# Altium project DE-020717.PrjPcb
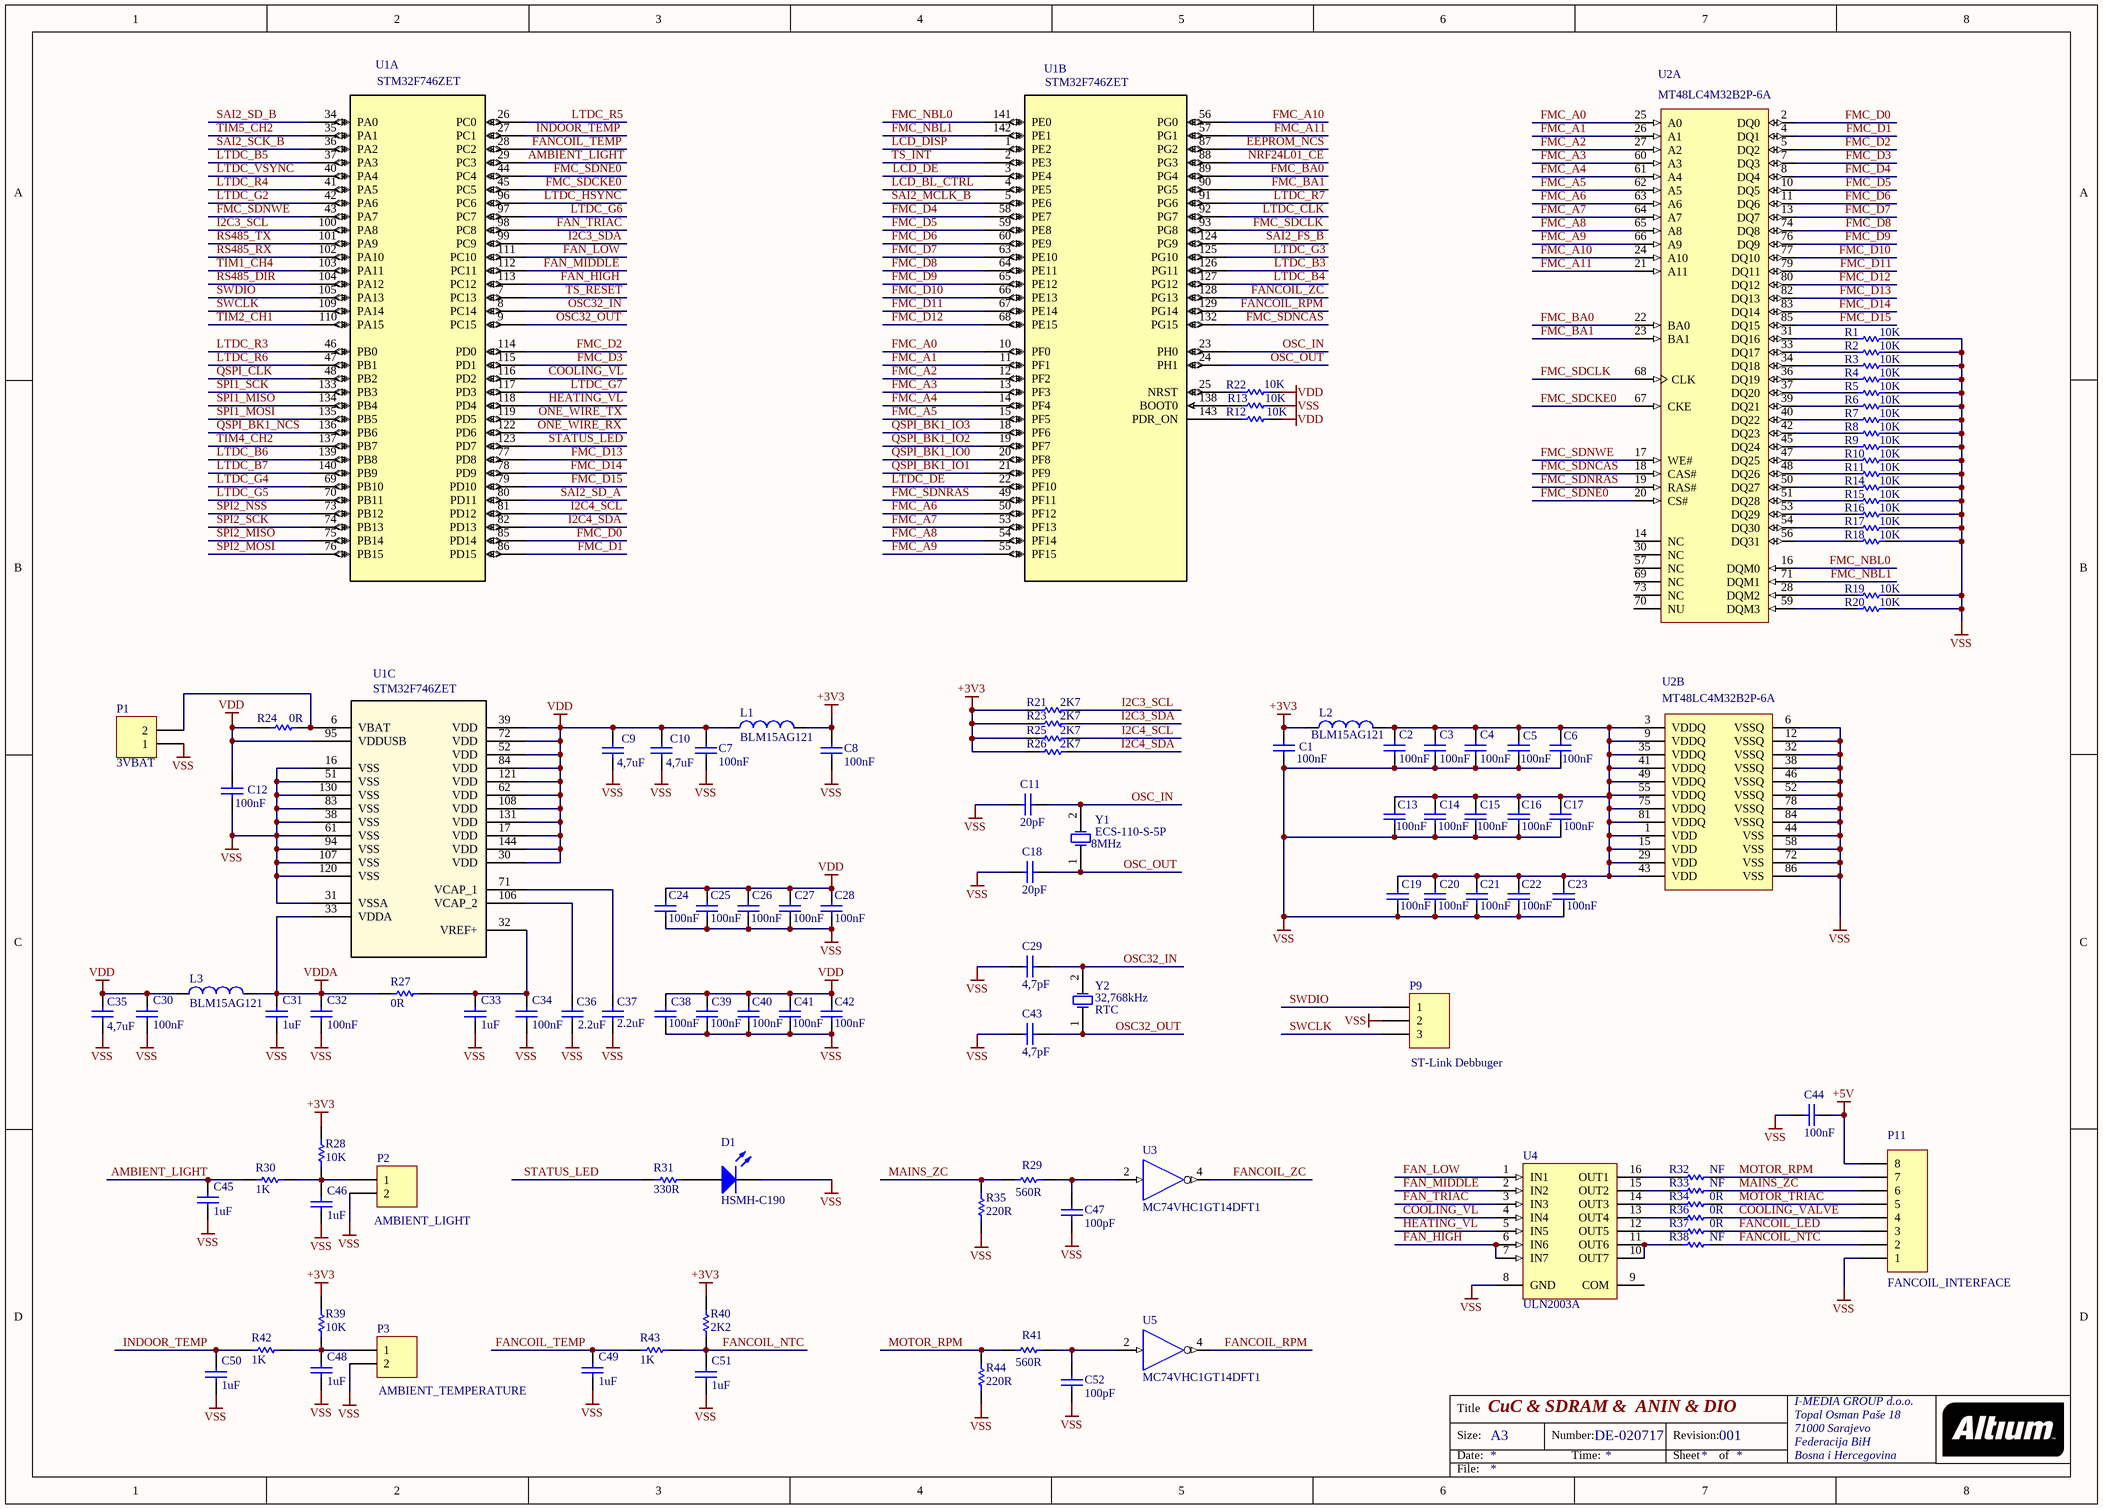
[diagram p0: DE-020717_1.SchDoc]
2 sheets, 178 parts. Net scope: global (net labels, ports and power ports of the same name join across sheets).
Board file: DE-020717.PcbDoc
Sheets:
  DE-020717_1.SchDoc
  DE-020717_2.SchDoc

## Sheet DE-020717_1.SchDoc: CuC & SDRAM &  ANIN & DIO
size A3; Author: eldar6776@hotmail.com; DrawnBy: Dedic Eldar; Organization: I-MEDIA GROUP d.o.o.; Address1: Topal Osman Paše 18; Address2: 71000 Sarajevo; Address3: Federacija BiH; Address4: Bosna i Hercegovina; DocumentNumber: DE-020717; Revision: 001

### Parts
C1  100nF  [0603]
C2  100nF  [0603]
C3  100nF  [0603]
C4  100nF  [0603]
C5  100nF  [0603]
C6  100nF  [0603]
C7  100nF  [0603]
C8  100nF  [0603]
C9  value 4,7uF  [0805]  (hidden comment: 4u7)
C10  value 4,7uF  [0805]  (hidden comment: 4u7)
C11  20pF  [0603]
C12  100nF  [0603]
C13  100nF  [0603]
C14  100nF  [0603]
C15  100nF  [0603]
C16  100nF  [0603]
C17  100nF  [0603]
C18  20pF  [0603]
C19  100nF  [0603]
C20  100nF  [0603]
C21  100nF  [0603]
C22  100nF  [0603]
C23  100nF  [0603]
C24  100nF  [0603]
C25  100nF  [0603]
C26  100nF  [0603]
C27  100nF  [0603]
C28  100nF  [0603]
C29  4,7pF  [0603]
C30  100nF  [0603]
C31  value 1uF  [0603]  (hidden comment: 100nF)
C32  100nF  [0603]
C33  value 1uF  [0603]  (hidden comment: 100nF)
C34  100nF  [0603]
C35  value 4,7uF  [0805]  (hidden comment: 4u7)
C36  value 2.2uF  [0603]  (hidden comment: 100nF)
C37  value 2.2uF  [0603]  (hidden comment: 100nF)
C38  100nF  [0603]
C39  100nF  [0603]
C40  100nF  [0603]
C41  100nF  [0603]
C42  100nF  [0603]
C43  4,7pF  [0603]
C44  100nF  [0603]
C45  value 1uF  [0603]  (hidden comment: 100nF)
C46  value 1uF  [0603]  (hidden comment: 100nF)
C47  100pF  [0603]
C48  value 1uF  [0603]  (hidden comment: 100nF)
C49  value 1uF  [0603]  (hidden comment: 100nF)
C50  value 1uF  [0603]  (hidden comment: 100nF)
C51  value 1uF  [0603]  (hidden comment: 100nF)
C52  100pF  [0603]
D1  HSMH-C190  [1.6X0.8X0.8A]
L1  BLM15AG121  [0603]
L2  BLM15AG121  [0603]
L3  BLM15AG121  [0603]
P1  3VBAT  [HDR1X2]
P2  AMBIENT_LIGHT  [HDR1X2]
P3  AMBIENT_TEMPERATURE  [HDR1X2]
P9  ST-Link Debbuger  [HDR1X3]
P11  FANCOIL_INTERFACE  [HDR1X8]
R1  10K  [2-0402]
R2  10K  [2-0402]
R3  10K  [2-0402]
R4  10K  [2-0402]
R5  10K  [2-0402]
R6  10K  [2-0402]
R7  10K  [2-0402]
R8  10K  [2-0402]
R9  10K  [2-0402]
R10  10K  [2-0402]
R11  10K  [2-0402]
R12  10K  [ERA-0603]
R13  10K  [ERA-0603]
R14  10K  [2-0402]
R15  10K  [2-0402]
R16  10K  [2-0402]
R17  10K  [2-0402]
R18  10K  [2-0402]
R19  10K  [2-0402]
R20  10K  [2-0402]
R21  2K7  [ERA-0603]
R22  10K  [ERA-0603]
R23  2K7  [ERA-0603]
R24  0R  [ERA-0603]
R25  2K7  [ERA-0603]
R26  2K7  [ERA-0603]
R27  0R  [ERA-0603]
R28  10K  [ERA-0603]
R29  560R  [ERA-0603]
R30  1K  [ERA-0603]
R31  330R  [ERA-0603]
R32  NF  [ERA-0603]
R33  NF  [ERA-0603]
R34  0R  [ERA-0603]
R35  220R  [ERA-0603]
R36  0R  [ERA-0603]
R37  0R  [ERA-0603]
R38  NF  [ERA-0603]
R39  10K  [ERA-0603]
R40  2K2  [ERA-0603]
R41  560R  [ERA-0603]
R42  1K  [ERA-0603]
R43  1K  [ERA-0603]
R44  220R  [ERA-0603]
U1  STM32F746ZET  [LQFP-144_20X20mm]  (parts A,B,C of 3)
U2  MT48LC4M32B2P-6A  [MICT-P-86_N]  (parts A,B of 2)
U3  MC74VHC1GT14DFT1  [419A-01_N]
U4  ULN2003A  [SO16_N]
U5  MC74VHC1GT14DFT1  [419A-01_N]
Y1  ECS-110-S-5P  value 8MHz  [CSM-7]
Y2  RTC  value 32,768kHz  [R38]

### Nets
+3V3: C1.2 C8.2 L1.2 L2.1 R21.1 R23.1 R25.1 R26.1 R28.2 R39.1 R40.2 U3.5(VDD) U5.5(VDD)
+5V: C44.2 P11.8
VDD: C7.2 C9.2 C10.2 C12.1 C24.2 C25.2 C26.2 C27.2 C28.2 C30.2 C35.2 C38.2 C39.2 C40.2 C41.2 C42.2 L1.1 L3.1 R12.2 R22.2 R24.1 U1.17(VDD) U1.30(VDD) U1.39(VDD) U1.52(VDD) U1.62(VDD) U1.72(VDD) U1.84(VDD) U1.95(VDDUSB) U1.108(VDD) U1.121(VDD) U1.131(VDD) U1.144(VDD)
VDDA: C31.2 C32.2 L3.2 R27.1 U1.33(VDDA)
VSS: C1.1 C2.1 C3.1 C4.1 C5.1 C6.1 C7.1 C8.1 C9.1 C10.1 C11.1 C12.2 C13.1 C14.1 C15.1 C16.1 C17.1 C18.1 C19.1 C20.1 C21.1 C22.1 C23.1 C24.1 C25.1 C26.1 C27.1 C28.1 C29.1 C30.1 C31.1 C32.1 C33.1 C34.1 C35.1 C36.1 C37.1 C38.1 C39.1 C40.1 C41.1 C42.1 C43.1 C44.1 C45.1 C46.1 C47.1 C48.1 C49.1 C50.1 C51.1 C52.1 D1.2(K) P1.1 P2.2 P3.2 P9.2 P11.1 R1.2 R2.2 R3.2 R4.2 R5.2 R6.2 R7.2 R8.2 R9.2 R10.2 R11.2 R13.2 R14.2 R15.2 R16.2 R17.2 R18.2 R19.2 R20.2 R35.1 R44.1 U1.16(VSS) U1.31(VSSA) U1.38(VSS) U1.51(VSS) U1.61(VSS) U1.83(VSS) U1.94(VSS) U1.107(VSS) U1.120(VSS) U1.130(VSS) U2.6(VSSQ) U2.12(VSSQ) U2.32(VSSQ) U2.38(VSSQ) U2.44(VSS) U2.46(VSSQ) U2.52(VSSQ) U2.58(VSS) U2.72(VSS) U2.78(VSSQ) U2.84(VSSQ) U2.86(VSS) U3.3(GND) U4.8(GND) U5.3(GND)
AMBIENT_LIGHT: C45.2 R30.1 U1.29(PC3)
COOLING_VALVE: P11.4 R36.2
COOLING_VL: U1.116(PD2) U4.4(IN4)
EEPROM_NCS: U1.87(PG2)
FAN_HIGH: U1.113(PC12) U4.6(IN6) U4.7(IN7)
FAN_LOW: U1.111(PC10) U4.1(IN1)
FAN_MIDDLE: U1.112(PC11) U4.2(IN2)
FAN_TRIAC: U1.98(PC8) U4.3(IN3)
FANCOIL_LED: P11.3 R37.2
FANCOIL_NTC: C51.2 P11.2 R38.2 R40.1 R43.2
FANCOIL_RPM: U1.129(PG14) U5.4(~{Y})
FANCOIL_TEMP: C49.2 R43.1 U1.28(PC2)
FANCOIL_ZC: U1.128(PG13) U3.4(~{Y})
FMC_A0: U1.10(PF0) U2.25(A0)
FMC_A1: U1.11(PF1) U2.26(A1)
FMC_A2: U1.12(PF2) U2.27(A2)
FMC_A3: U1.13(PF3) U2.60(A3)
FMC_A4: U1.14(PF4) U2.61(A4)
FMC_A5: U1.15(PF5) U2.62(A5)
FMC_A6: U1.50(PF12) U2.63(A6)
FMC_A7: U1.53(PF13) U2.64(A7)
FMC_A8: U1.54(PF14) U2.65(A8)
FMC_A9: U1.55(PF15) U2.66(A9)
FMC_A10: U1.56(PG0) U2.24(A10)
FMC_A11: U1.57(PG1) U2.21(A11)
FMC_BA0: U1.89(PG4) U2.22(BA0)
FMC_BA1: U1.90(PG5) U2.23(BA1)
FMC_D0: U1.85(PD14) U2.2(DQ0)
FMC_D1: U1.86(PD15) U2.4(DQ1)
FMC_D2: U1.114(PD0) U2.5(DQ2)
FMC_D3: U1.115(PD1) U2.7(DQ3)
FMC_D4: U1.58(PE7) U2.8(DQ4)
FMC_D5: U1.59(PE8) U2.10(DQ5)
FMC_D6: U1.60(PE9) U2.11(DQ6)
FMC_D7: U1.63(PE10) U2.13(DQ7)
FMC_D8: U1.64(PE11) U2.74(DQ8)
FMC_D9: U1.65(PE12) U2.76(DQ9)
FMC_D10: U1.66(PE13) U2.77(DQ10)
FMC_D11: U1.67(PE14) U2.79(DQ11)
FMC_D12: U1.68(PE15) U2.80(DQ12)
FMC_D13: U1.77(PD8) U2.82(DQ13)
FMC_D14: U1.78(PD9) U2.83(DQ14)
FMC_D15: U1.79(PD10) U2.85(DQ15)
FMC_NBL0: U1.141(PE0) U2.16(DQM0)
FMC_NBL1: U1.142(PE1) U2.71(DQM1)
FMC_SDCKE0: U1.45(PC5) U2.67(CKE)
FMC_SDCLK: U1.93(PG8) U2.68(CLK)
FMC_SDNCAS: U1.132(PG15) U2.18(CAS#)
FMC_SDNE0: U1.44(PC4) U2.20(CS#)
FMC_SDNRAS: U1.49(PF11) U2.19(RAS#)
FMC_SDNWE: U1.43(PA7) U2.17(WE#)
HEATING_VL: U1.118(PD4) U4.5(IN5)
I2C3_SCL: R21.2 U1.100(PA8)
I2C3_SDA: R23.2 U1.99(PC9)
I2C4_SCL: R25.2 U1.81(PD12)
I2C4_SDA: R26.2 U1.82(PD13)
INDOOR_TEMP: C50.2 R42.1 U1.27(PC1)
LCD_BL_CTRL: U1.4(PE5)
LCD_DE: U1.3(PE4)
LCD_DISP: U1.1(PE2)
LTDC_B3: U1.126(PG11)
LTDC_B4: U1.127(PG12)
LTDC_B5: U1.37(PA3)
LTDC_B6: U1.139(PB8)
LTDC_B7: U1.140(PB9)
LTDC_CLK: U1.92(PG7)
LTDC_DE: U1.22(PF10)
LTDC_G2: U1.42(PA6)
LTDC_G3: U1.125(PG10)
LTDC_G4: U1.69(PB10)
LTDC_G5: U1.70(PB11)
LTDC_G6: U1.97(PC7)
LTDC_G7: U1.117(PD3)
LTDC_HSYNC: U1.96(PC6)
LTDC_R3: U1.46(PB0)
LTDC_R4: U1.41(PA5)
LTDC_R5: U1.26(PC0)
LTDC_R6: U1.47(PB1)
LTDC_R7: U1.91(PG6)
LTDC_VSYNC: U1.40(PA4)
MAINS_ZC: P11.6 R29.1 R33.2 R35.2
MOTOR_RPM: P11.7 R32.2 R41.1 R44.2
MOTOR_TRIAC: P11.5 R34.2
NRF24L01_CE: U1.88(PG3)
ONE_WIRE_RX: U1.122(PD6)
ONE_WIRE_TX: U1.119(PD5)
OSC32_IN: C29.2 U1.8(PC14) Y2.2(OSC2)
OSC32_OUT: C43.2 U1.9(PC15) Y2.1(OSC1)
OSC_IN: C11.2 U1.23(PH0) Y1.2(OSC2)
OSC_OUT: C18.2 U1.24(PH1) Y1.1(OSC1)
QSPI_BK1_IO0: U1.20(PF8)
QSPI_BK1_IO1: U1.21(PF9)
QSPI_BK1_IO2: U1.19(PF7)
QSPI_BK1_IO3: U1.18(PF6)
QSPI_BK1_NCS: U1.136(PB6)
QSPI_CLK: U1.48(PB2)
RS485_DIR: U1.104(PA12)
RS485_RX: U1.102(PA10)
RS485_TX: U1.101(PA9)
SAI2_FS_B: U1.124(PG9)
SAI2_MCLK_B: U1.5(PE6)
SAI2_SCK_B: U1.36(PA2)
SAI2_SD_A: U1.80(PD11)
SAI2_SD_B: U1.34(PA0)
SPI1_MISO: U1.134(PB4)
SPI1_MOSI: U1.135(PB5)
SPI1_SCK: U1.133(PB3)
SPI2_MISO: U1.75(PB14)
SPI2_MOSI: U1.76(PB15)
SPI2_NSS: U1.73(PB12)
SPI2_SCK: U1.74(PB13)
STATUS_LED: R31.2 U1.123(PD7)
SWCLK: P9.3 U1.109(PA14)
SWDIO: P9.1 U1.105(PA13)
TIM1_CH4: U1.103(PA11)
TIM2_CH1: U1.110(PA15)
TIM4_CH2: U1.137(PB7)
TIM5_CH2: U1.35(PA1)
TS_INT: U1.2(PE3)
TS_RESET: U1.7(PC13)
NetC2_2: C2.2 C3.2 C4.2 C5.2 C6.2 C13.2 C14.2 C15.2 C16.2 C17.2 C19.2 C20.2 C21.2 C22.2 C23.2 L2.2 U2.1(VDD) U2.3(VDDQ) U2.9(VDDQ) U2.15(VDD) U2.29(VDD) U2.35(VDDQ) U2.41(VDDQ) U2.43(VDD) U2.49(VDDQ) U2.55(VDDQ) U2.75(VDDQ) U2.81(VDDQ)
NetC33_2: C33.2 C34.2 R27.2 U1.32(VREF+)
NetC36_2: C36.2 U1.106(VCAP_2)
NetC37_2: C37.2 U1.71(VCAP_1)
NetC46_2: C46.2 P2.1 R28.1 R30.2
NetC47_2: C47.2 R29.2 U3.2(A)
NetC48_2: C48.2 P3.1 R39.2 R42.2
NetC52_2: C52.2 R41.2 U5.2(A)
NetD1_1: D1.1(A) R31.1
NetP1_2: P1.2 R24.2 U1.6(VBAT)
NetR1_1: R1.1 U2.31(DQ16)
NetR2_1: R2.1 U2.33(DQ17)
NetR3_1: R3.1 U2.34(DQ18)
NetR4_1: R4.1 U2.36(DQ19)
NetR5_1: R5.1 U2.37(DQ20)
NetR6_1: R6.1 U2.39(DQ21)
NetR7_1: R7.1 U2.40(DQ22)
NetR8_1: R8.1 U2.42(DQ23)
NetR9_1: R9.1 U2.45(DQ24)
NetR10_1: R10.1 U2.47(DQ25)
NetR11_1: R11.1 U2.48(DQ26)
NetR12_1: R12.1 U1.143(PDR_ON)
NetR13_1: R13.1 U1.138(BOOT0)
NetR14_1: R14.1 U2.50(DQ27)
NetR15_1: R15.1 U2.51(DQ28)
NetR16_1: R16.1 U2.53(DQ29)
NetR17_1: R17.1 U2.54(DQ30)
NetR18_1: R18.1 U2.56(DQ31)
NetR19_1: R19.1 U2.28(DQM2)
NetR20_1: R20.1 U2.59(DQM3)
NetR22_1: R22.1 U1.25(NRST)
NetR32_1: R32.1 U4.16(OUT1)
NetR33_1: R33.1 U4.15(OUT2)
NetR34_1: R34.1 U4.14(OUT3)
NetR36_1: R36.1 U4.13(OUT4)
NetR37_1: R37.1 U4.12(OUT5)
NetR38_1: R38.1 U4.10(OUT7) U4.11(OUT6)

Not connected (* = marked no-connect by the designer): U2 14(NC) 30(NC) 57(NC) 69(NC) 70(NU) 73(NC); U4 9(COM)

### Notes on the sheet
- Title
- Size:
- Date:
- A3
- Number:
- Time:
- Revision:
- Sheet
- of
- File:

### Library data of the parts
C1-C8 C11-C34 C36-C52 = C0603: Ceramic Chip Capacitor - Standard; Note: Footprint corresponds to dimensions for bulk cassette packaging. This case size has tightened tolerances.; Published: 17-Jul-2002; LatestRevisionDate: 19-Mar-2004; LatestRevisionNote: Silkscreen size reduced.; DatasheetDocument: Mar-2001; PackageDocument: Mar-2001; PackageReference: 0603; Publisher: Altium Limited; Code_JEITA: 0603; Code_IPC: 1608 [0603]; ComponentLink1Description: Manufacturer Link; ComponentLink1URL: http://www.kemet.com/; ComponentLink2Description: Datasheet; ComponentLink2URL: http://www.kemet.com/kemet/web/homepage/kechome.nsf/vapubfilesname/F3102TA.pdf/$file/F3102TA.pdf
  C1-C8 C12-C17 C19-C28 C30 C32 C34 C38-C42 C44: Value: 100nF
  C11 C18: Value: 20pF
  C29 C43: Value: 4,7pF
  C47 C52: Value: 100pF
C9 C10 C35 = C0805: Ceramic Chip Capacitor - Standard; Note: Footprint corresponds to dimensions for bulk cassette packaging. This case size has tightened tolerances.; Published: 17-Jul-2002; LatestRevisionDate: 19-Mar-2004; LatestRevisionNote: Silkscreen size reduced.; DatasheetDocument: Mar-2001; PackageDocument: Mar-2001; PackageReference: 0805; Publisher: Altium Limited; Code_JEITA: 0805; Code_IPC: 2012[0805]; ComponentLink1Description: Manufacturer Link; ComponentLink1URL: http://www.kemet.com/; ComponentLink2Description: Datasheet; ComponentLink2URL: http://www.kemet.com/kemet/web/homepage/kechome.nsf/vapubfilesname/F3102TA.pdf/$file/F3102TA.pdf
D1 = HSMH-C190: Surface Mount Chip LED, Red; LuminousIntensity: 6.3mcd (Minimum).; PCB_Layout: Complies with manufacturer's recommendation.; Note: Anode mark shown on package.; Published: 11-Dec-2002; LatestRevisionDate: 27-Jun-2008; LatestRevisionNote: Polarity swapped to match Anode Mark.; DatasheetVersion: 30-Apr-2002; PackageVersion: Mar-2002; PackageReference: 1.6X0.8X0.8A; Publisher: Altium Limited; PackageDescription: SM LED; 2 Flat Leads; LED_Colour: Red; ComponentLink1Description: Manufacturer Link; ComponentLink1URL: http://www.avagotech.com/; ComponentLink2Description: Datasheet; ComponentLink2URL: http://cp.literature.agilent.com/litweb/pdf/5988-6271EN.pdf
L1-L3 = Inductor_SMD: Inductor; Code_IEC: 1005; Published: 8-Jun-2000; LatestRevisionDate: 29-May-2009; LatestRevisionNote: IPC-7351 Footprint Added.; PackageReference: 0402-A; Publisher: Altium Limited; PackageDescription: Chip Inductor; Code_JEITA: 0402
P1-P3 = Header 2: Header, 2-Pin; LatestRevisionDate: 17-Jul-2002; LatestRevisionNote: Re-released for DXP Platform.; Publisher: Altium Limited
P9 = Header 3: Header, 3-Pin; LatestRevisionDate: 17-Jul-2002; LatestRevisionNote: Re-released for DXP Platform.; Publisher: Altium Limited
P11 = Header 8: Header, 8-Pin; LatestRevisionDate: 17-Jul-2002; LatestRevisionNote: Re-released for DXP Platform.; Publisher: Altium Limited
R1-R11 R14-R20 = ERJ2GE: Thick Film Chip Resistor, 1 Ohm to 2.2M Ohm Range, 5% Tolerance, 0402 Size, 0.063 W; Note: If flow soldering, adjust pad width of PCB Footprint to 0.7 - 0.8 times the width of the resistor.; Published: 17-Dec-2003; LatestRevisionDate: 19-Mar-2004; LatestRevisionNote: Silkscreen size reduced.; PackageDocument: Mar-2003; PackageReference: 2-0402; Publisher: Altium Limited; Code_IPC: 1005 [0402]; ComponentLink1Description: Manufacturer Link; ComponentLink1URL: http://www.panasonic.com/industrial/components/resistive_products.htm; ComponentLink2Description: Datasheet; ComponentLink2URL: http://www.panasonic.com/industrial/components/pdf/AOA0000CE1.pdf
R12 R13 R21-R44 = ERA3Y: Rectangular Thick Film Chip Resistor, 10 Ohm to 330k Ohm Range, 0.1% and 0.5% Tolerance, 0603 Size, 0.063 W; Note: If flow soldering, adjust pad width of PCB Footprint to 0.7 - 0.8 times the width of the resistor.; Published: 17-Dec-2003; LatestRevisionDate: 19-Mar-2004; LatestRevisionNote: Silkscreen size reduced.; PackageDocument: Mar-2003; PackageReference: ERA-0603; Publisher: Altium Limited; Code_IPC: 1608 [0603]; ComponentLink1Description: Manufacturer Link; ComponentLink1URL: http://www.panasonic.com/industrial/components/resistive_products.htm; ComponentLink2Description: Datasheet; ComponentLink2URL: http://www.panasonic.com/industrial/components/pdf/AOA0000CE8.pdf
U1 = STM32F74XZXT: STM32F746ZET ARM Cortex M7 microcontroller; Vendor: STMicroelectronics; C: Copyright (C) 2016 Accelerated Designs. All rights reserved; Manufacturer_Part_Number: stm32f74xzxt; Copyright: Copyright (C) 2016 Accelerated Designs. All rights reserved; RefDes: RefDes; Type: Type; Value: Value
U2 = MT48LC4M32B2P-6A: 128Mb PC133 SDR SDRAM, 4Mb x 32, 6ns, 3.3V, 0 to 70 degC, 86-Pin TSOP, Pb-Free; Manufacturer: Micron; CL: CL = 3; Clock Rate: 166 MHz; Op. Temp.: 0C to +70C; DatasheetVersion: Rev.Q; PackageVersion: Rev.Q; PackageReference: MICT-P-86; PackageDescription: 86-PinThin Small Outline Package, 10.16 x 22.22 mm, Pitch 0.5 mm; Cycle Time: 6ns; Data Rate: PC133; Density: 128Mb; Depth: 4Mb; RoHS: Yes; Voltage: 3.3V; Width: x32; Mounting Technology: Surface Mount; PartNumber: MT48LC4M32B2P-6A; ComponentLink1Description: Manufacturer URL; ComponentLink1URL: http://www.micron.com/; ComponentLink2Description: Datasheet; ComponentLink2URL: http://www.micron.com/~/media/Documents/Products/Data%20Sheet/DRAM/128mb_x32_sdram.pdf; ComponentLink3Description: Package Specification; ComponentLink3URL: http://www.micron.com/~/media/Documents/Products/Data%20Sheet/DRAM/128mb_x32_sdram.pdf
U3 U5 = MC74VHC1GT14DFT1: Schmitt-Trigger Inverter / Logic Level Shifter with LSTTL-Compatible Inputs; Note: Pin 1 is NC and is not drawn.; Published: 15-Apr-2002; LatestRevisionDate: 12-Dec-2006; LatestRevisionNote: IPC-7351 Footprint Added.; DatasheetVersion: Nov-1999; PackageVersion: Oct-1999; PackageReference: 419A-01; Publisher: Altium Limited; PackageDescription: 5-Pin SOT-353 Package 0.65 mm Pitch, 2.1 mm Lead Span; ComponentLink1Description: Manufacturer Link; ComponentLink1URL: http://www.onsemi.com/; ComponentLink2Description: Datasheet; ComponentLink2URL: http://www.onsemi.com/pub/Collateral/MC74VHC1GT14-D.PDF
U4 = ULN2003D: Seven Darlington Array; Published: 8-Jun-2000; LatestRevisionDate: 13-Apr-2006; LatestRevisionNote: IPC-7351 Footprint Added.; DatasheetVersion: Sep-1998; PackageVersion: May-1998; PackageReference: SO16; Publisher: Altium Limited; PackageDescription: 16-Pin Small Outline Integrated Circuit 1.27 mm Pitch; Code_IPC: SOIC127P600-16; ComponentLink1Description: Manufacturer Link; ComponentLink1URL: http://www.st.com/; ComponentLink2Description: Datasheet; ComponentLink2URL: http://www.st.com/stonline/products/literature/ds/5279/uln2001.pdf
Y1 = ECS-110-S-5P: Crystal Oscillator; Published: 17-Jul-2002; DatasheetDocument: 18-Apr-2000; PackageReference: CSM-7; Publisher: Altium Limited; ComponentLink1Description: Manufacturer Link; ComponentLink1URL: http://www.ecsxtal.com/; ComponentLink2Description: Datasheet; ComponentLink2URL: http://www.ecsxtal.com/pdf3/CSM_7.pdf
Y2 = XTAL: Crystal Oscillator; Published: 8-Jun-2000; LatestRevisionDate: 17-Jul-2002; LatestRevisionNote: Re-released for DXP Platform.; PackageReference: R38; Publisher: Altium Limited; PackageDescription: Crystal, Thru-Hole; 2 Leads; Body 3.1 x 8.2 mm (Dia.xH)

## Sheet DE-020717_2.SchDoc: COM & WIFI
size A3; Author: eldar6776@hotmail.com; DrawnBy: Eldar Dedic; Organization: I-MEDIA GROUP d.o.o.; Address1: Topal Osman Paše 18; Address2: Sarajevo 71000; Address3: Federacija BiH; Address4: Bosna i Hercegovina; DocumentNumber: DE-020717; Revision: 001
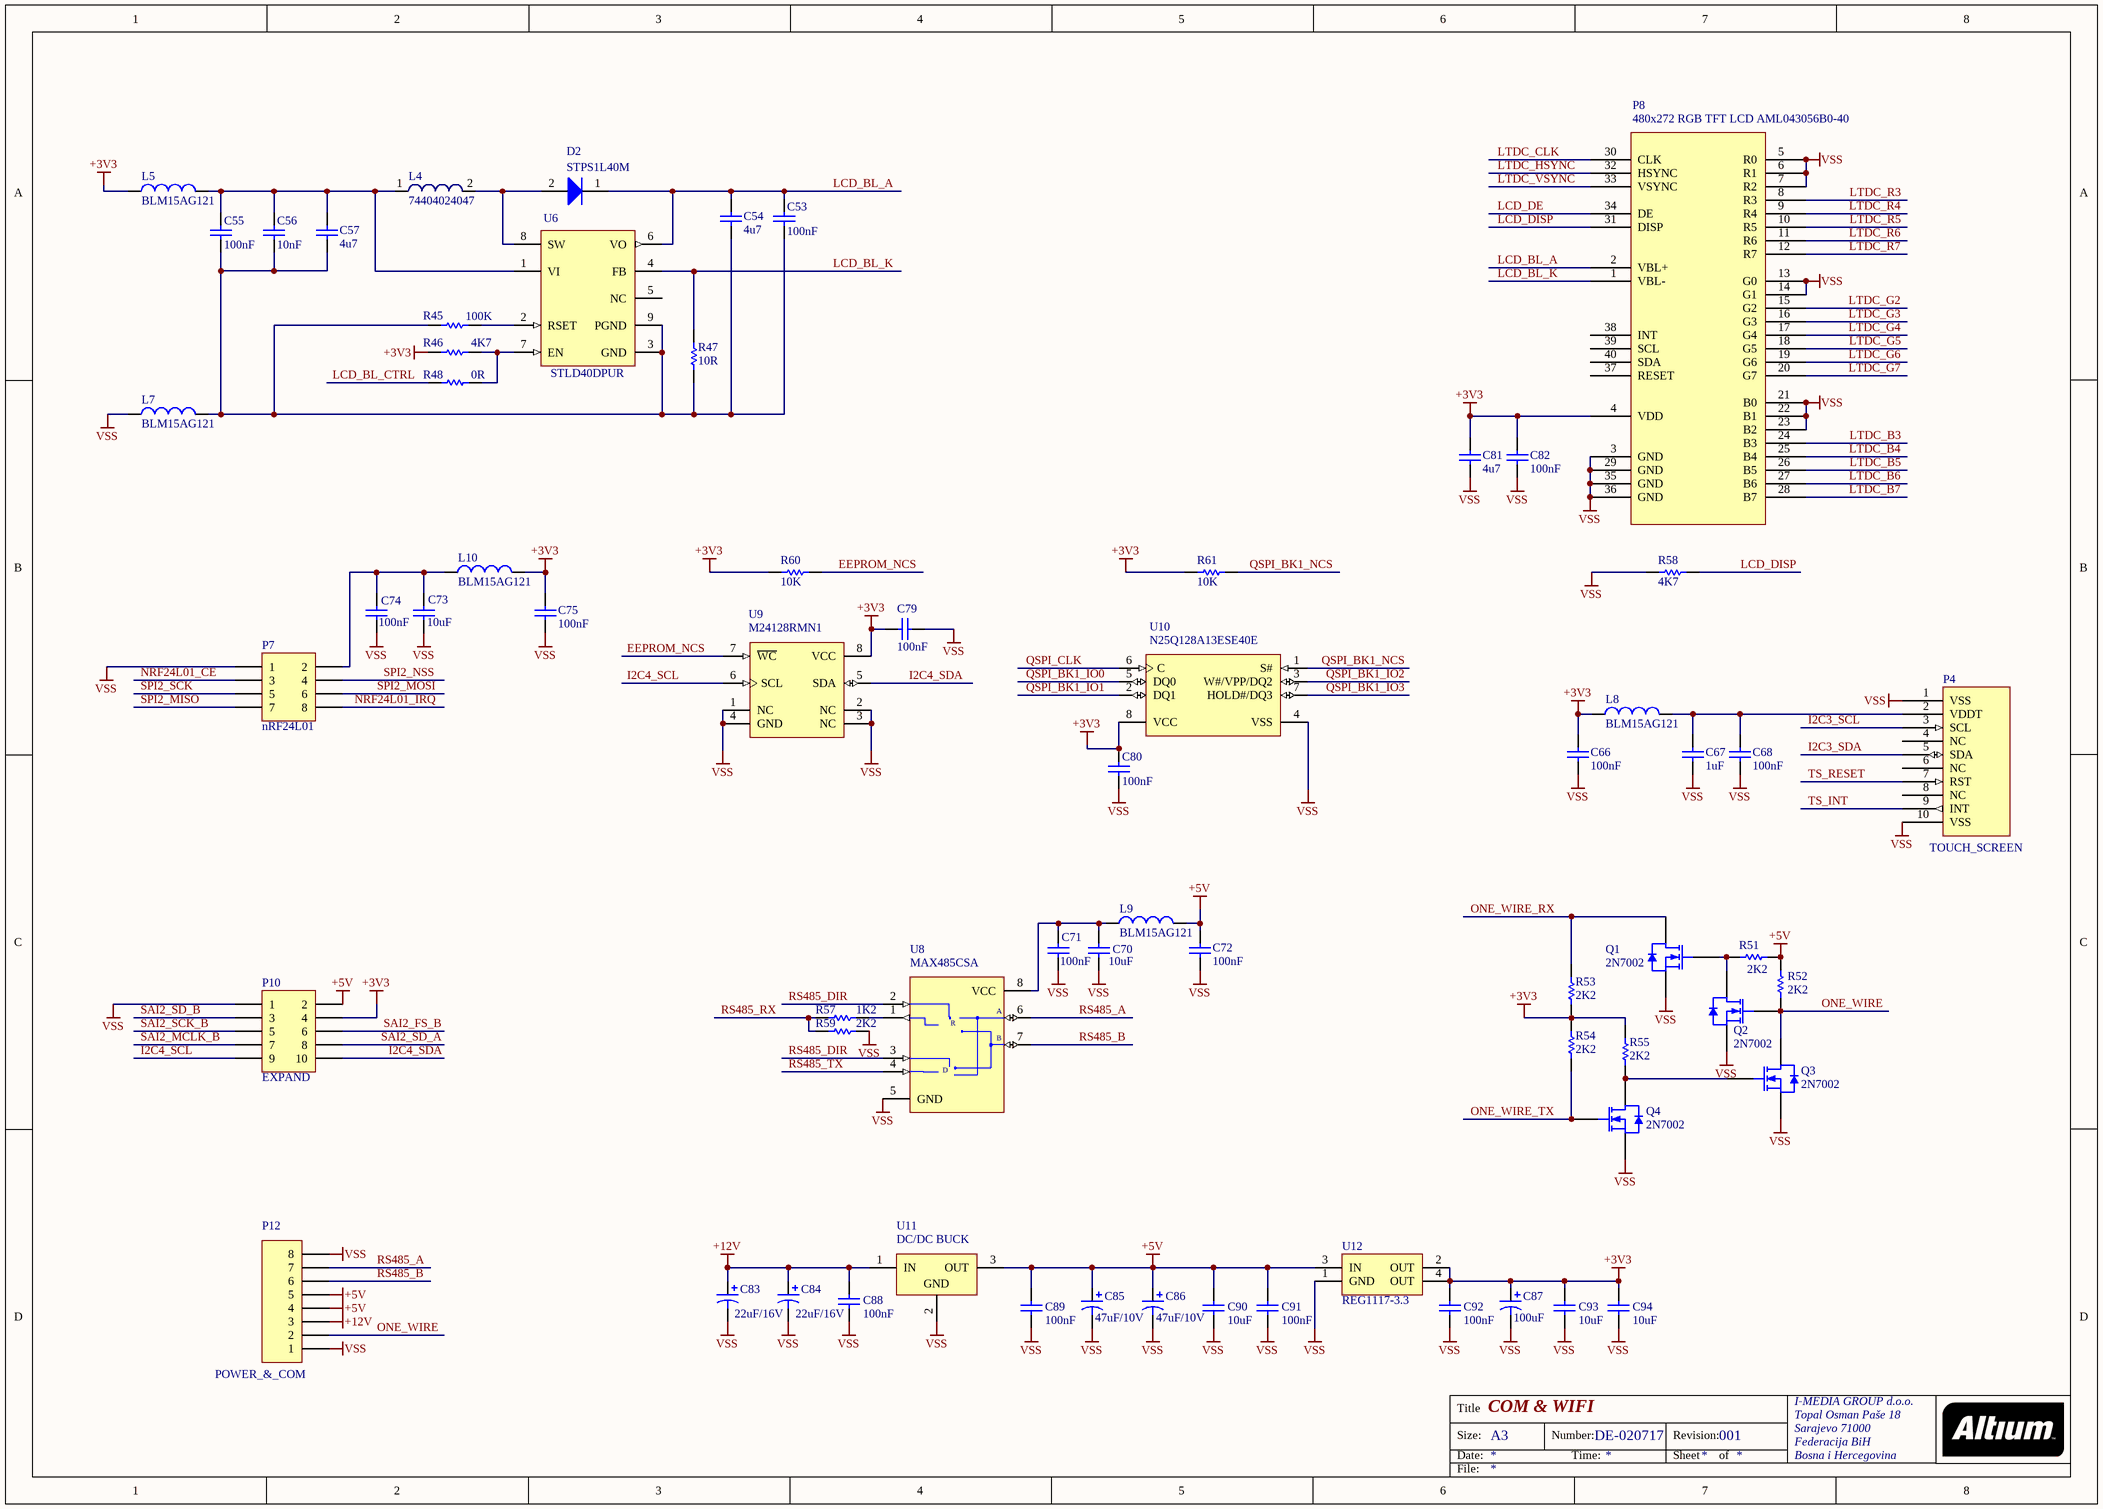
[diagram p1: DE-020717_2.SchDoc]

### Parts
C53  100nF  [0603]
C54  4u7  [0805]
C55  100nF  [0603]
C56  value 10nF  [0603]  (hidden comment: 100nF)
C57  4u7  [0805]
C66  100nF  [0603]
C67  1uF  [0603]
C68  100nF  [0603]
C70  value 10uF  [0805]  (hidden comment: 4u7)
C71  100nF  [0603]
C72  100nF  [0603]
C73  value 10uF  [0805]  (hidden comment: 4u7)
C74  100nF  [0603]
C75  100nF  [0603]
C79  100nF  [0603]
C80  100nF  [0603]
C81  4u7  [0805]
C82  100nF  [0603]
C83  22uF/16V  [3528]
C84  22uF/16V  [3528]
C85  47uF/10V  [3528]
C86  47uF/10V  [3528]
C87  100uF  [3528]
C88  100nF  [0603]
C89  100nF  [0603]
C90  10uF  [0805]
C91  100nF  [0603]
C92  100nF  [0603]
C93  10uF  [0805]
C94  10uF  [0805]
D2  STPS1L40M  [ONSC-SOD-123-2-425-04_V]
L4  74404024047  [WE-LQS 252012]
L5  BLM15AG121  [0603]
L7  BLM15AG121  [0603]
L8  BLM15AG121  [0603]
L9  BLM15AG121  [0603]
L10  BLM15AG121  [0603]
P4  TOUCH_SCREEN  [10 pin PFC]
P7  nRF24L01  [HDR2X4]
P8  480x272 RGB TFT LCD AML043056B0-40  [40 pin FPC]
P10  EXPAND  [HDR2X5]
P12  POWER_&_COM  [HDR1X8]
Q1  2N7002  [SOT23_N]
Q2  2N7002  [SOT23_N]
Q3  2N7002  [SOT23_N]
Q4  2N7002  [SOT23_N]
R45  100K  [ERA-0603]
R46  4K7  [ERA-0603]
R47  10R  [ERA-0805]
R48  0R  [ERA-0603]
R51  2K2  [ERA-0603]
R52  2K2  [ERA-0603]
R53  2K2  [ERA-0603]
R54  2K2  [ERA-0603]
R55  2K2  [ERA-0603]
R57  1K2  [ERA-0603]
R58  4K7  [ERA-0603]
R59  2K2  [ERA-0603]
R60  10K  [ERA-0603]
R61  10K  [ERA-0603]
U6  STLD40DPUR  [QFN8_V]
U8  MAX485CSA  [NSO8_N]
U9  M24128RMN1  [SOP8_N]
U10  N25Q128A13ESE40E  [MICT-SE-8_N]
U11  DC/DC BUCK  [TO220]
U12  REG1117-3.3  [ZZ311]

### Nets
+3V3: C66.2 C75.2 C79.2 C80.1 C81.2 C82.2 C87.1 C92.2 C93.2 C94.2 L5.1 L8.1 L10.2 P8.4(VDD) P10.4 R46.2 R53.1 R54.2 R55.2 R60.1 R61.1 U9.8(VCC) U10.8(VCC) U12.2(OUT) U12.4(OUT)
+5V: C72.2 C85.1 C86.1 C89.2 C90.2 C91.2 L9.2 P10.2 P12.4 P12.5 R51.1 R52.2 U11.3(OUT) U12.3(IN)
+12V: C83.1 C84.1 C88.2 P12.3 U11.1(IN)
VSS: C66.1 C67.1 C68.1 C70.1 C71.1 C72.1 C73.1 C74.1 C75.1 C79.1 C80.2 C81.1 C82.1 C83.2 C84.2 C85.2 C86.2 C87.2 C88.1 C89.1 C90.1 C91.1 C92.1 C93.1 C94.1 L7.1 P4.1(VSS) P4.10(VSS) P7.1 P8.3(GND) P8.5(R0) P8.6(R1) P8.7(R2) P8.13(G0) P8.14(G1) P8.21(B0) P8.22(B1) P8.23(B2) P8.29(GND) P8.35(GND) P8.36(GND) P10.1 P12.1 P12.8 Q1.2(S) Q2.2(S) Q3.2(S) Q4.2(S) R58.1 R59.2 U8.5(GND) U9.1(NC) U9.2(NC) U9.3(NC) U9.4(GND) U10.4(VSS) U11.2(GND) U12.1(GND)
EEPROM_NCS: R60.2 U9.7(~{WC})
I2C3_SCL: P4.3(SCL)
I2C3_SDA: P4.5(SDA)
I2C4_SCL: P10.9 U9.6(SCL)
I2C4_SDA: P10.10 U9.5(SDA)
LCD_BL_A: C53.1 C54.2 D2.1(K) P8.2(VBL+) U6.6(VO)
LCD_BL_CTRL: R48.2
LCD_BL_K: P8.1(VBL-) R47.2 U6.4(FB)
LCD_DE: P8.34(DE)
LCD_DISP: P8.31(DISP) R58.2
LTDC_B3: P8.24(B3)
LTDC_B4: P8.25(B4)
LTDC_B5: P8.26(B5)
LTDC_B6: P8.27(B6)
LTDC_B7: P8.28(B7)
LTDC_CLK: P8.30(CLK)
LTDC_G2: P8.15(G2)
LTDC_G3: P8.16(G3)
LTDC_G4: P8.17(G4)
LTDC_G5: P8.18(G5)
LTDC_G6: P8.19(G6)
LTDC_G7: P8.20(G7)
LTDC_HSYNC: P8.32(HSYNC)
LTDC_R3: P8.8(R3)
LTDC_R4: P8.9(R4)
LTDC_R5: P8.10(R5)
LTDC_R6: P8.11(R6)
LTDC_R7: P8.12(R7)
LTDC_VSYNC: P8.33(VSYNC)
NRF24L01_CE: P7.3
NRF24L01_IRQ: P7.8
ONE_WIRE: P12.2 Q2.1(G) Q3.3(D) R52.1
ONE_WIRE_RX: Q1.3(D) R53.2
ONE_WIRE_TX: Q4.1(G) R54.1
QSPI_BK1_IO0: U10.5(DQ0)
QSPI_BK1_IO1: U10.2(DQ1)
QSPI_BK1_IO2: U10.3(W#/VPP/DQ2)
QSPI_BK1_IO3: U10.7(HOLD#/DQ3)
QSPI_BK1_NCS: R61.2 U10.1(S#)
QSPI_CLK: U10.6(C)
RS485_A: P12.7 U8.6(A)
RS485_B: P12.6 U8.7(B)
RS485_DIR: U8.2(~{RE}) U8.3(DE)
RS485_RX: R57.1 R59.1
RS485_TX: U8.4(DI)
SAI2_FS_B: P10.6
SAI2_MCLK_B: P10.7
SAI2_SCK_B: P10.5
SAI2_SD_A: P10.8
SAI2_SD_B: P10.3
SPI2_MISO: P7.7
SPI2_MOSI: P7.6
SPI2_NSS: P7.4
SPI2_SCK: P7.5
TS_INT: P4.9(INT)
TS_RESET: P4.7(RST)
NetC53_2: C53.2 C54.1 C55.2 C56.2 C57.2 L7.2 R45.2 R47.1 U6.3(GND) U6.9(PGND)
NetC55_1: C55.1 C56.1 C57.1 L4.1 L5.2 U6.1(VI)
NetC67_2: C67.2 C68.2 L8.2 P4.2(VDDT)
NetC70_2: C70.2 C71.2 L9.1 U8.8(VCC)
NetC73_2: C73.2 C74.2 L10.1 P7.2
NetD2_2: D2.2(A) L4.2 U6.8(SW)
NetQ1_1: Q1.1(G) Q2.3(D) R51.2
NetQ3_1: Q3.1(G) Q4.3(D) R55.1
NetR45_1: R45.1 U6.2(RSET)
NetR46_1: R46.1 R48.1 U6.7(EN)
NetR57_2: R57.2 U8.1(RO)

Not connected (* = marked no-connect by the designer): P4 4(NC) 6(NC) 8(NC); P8 37(RESET) 38(INT) 39(SCL) 40(SDA); U6 5(NC)

### Notes on the sheet
- Title
- Size:
- Date:
- A3
- Number:
- Time:
- Revision:
- Sheet
- of
- File:
- (in symbol MAX485CSA) R; D

### Library data of the parts
C53 C55 C56 C66 C68 C71 C72 C74 C75 C79 C80 C82 C88 C89 C91 C92 = C0603: as C1 on sheet DE-020717_1; Published: 17-Jul-2002; LatestRevisionDate: 19-Mar-2004; LatestRevisionNote: Silkscreen size reduced.; DatasheetDocument: Mar-2001; PackageDocument: Mar-2001; PackageReference: 0603; Publisher: Altium Limited; Code_JEITA: 0603; Code_IPC: 1608 [0603]; ComponentLink1Description: Manufacturer Link; ComponentLink1URL: http://www.kemet.com/; ComponentLink2Description: Datasheet; ComponentLink2URL: http://www.kemet.com/kemet/web/homepage/kechome.nsf/vapubfilesname/F3102TA.pdf/$file/F3102TA.pdf
  C53 C55 C66 C68 C71 C72 C74 C75 C79 C80 C82 C88 C89 C91 C92: Value: 100nF
C54 C57 C70 C73 C81 C90 C93 C94 = C0805: as C9 on sheet DE-020717_1; Published: 17-Jul-2002; LatestRevisionDate: 19-Mar-2004; LatestRevisionNote: Silkscreen size reduced.; DatasheetDocument: Mar-2001; PackageDocument: Mar-2001; PackageReference: 0805; Publisher: Altium Limited; Code_JEITA: 0805; Code_IPC: 2012[0805]; ComponentLink1Description: Manufacturer Link; ComponentLink1URL: http://www.kemet.com/; ComponentLink2Description: Datasheet; ComponentLink2URL: http://www.kemet.com/kemet/web/homepage/kechome.nsf/vapubfilesname/F3102TA.pdf/$file/F3102TA.pdf
  C54 C57 C81: Value: 4u7
  C90 C93 C94: Value: 10uF
C67 = C0603: Ceramic Chip Capacitor - Standard; Note: Footprint corresponds to dimensions for bulk cassette packaging. This case size has tightened tolerances.; Value: 100nF; Published: 17-Jul-2002; LatestRevisionDate: 19-Mar-2004; LatestRevisionNote: Silkscreen size reduced.; DatasheetDocument: Mar-2001; PackageDocument: Mar-2001; PackageReference: 0603; Publisher: Altium Limited; Code_JEITA: 0603; Code_IPC: 1608 [0603]; ComponentLink1Description: Manufacturer Link; ComponentLink1URL: http://www.kemet.com/; ComponentLink2Description: Datasheet; ComponentLink2URL: http://www.kemet.com/kemet/web/homepage/kechome.nsf/vapubfilesname/F3102TA.pdf/$file/F3102TA.pdf
C83-C86 = 293D156X0004B2: Tantamount Commercial, Surface Mount Solid Tantalum Chip Capacitor: 15uF, 20% Tolerance, 4 WVDC @ +85°C, Surge = 5.2V; Note: See Data Sheet for full range of components; Published: 19-Mar-2004; DatasheetDocument: 05-Feb-2003; PackageReference: 3528; Publisher: Altium Limited; Code_JEITA: 3528; ComponentLink1Description: Manufacturer Link; ComponentLink1URL: http://www.vishay.com/; ComponentLink2Description: Datasheet; ComponentLink2URL: http://www.vishay.com/docs/40002/293d.pdf
  C83 C84: Value: 22uF/16V
  C85 C86: Value: 47uF/10V
C87 = 293D156X0004B2: Tantamount Commercial, Surface Mount Solid Tantalum Chip Capacitor: 15uF, 20% Tolerance, 4 WVDC @ +85°C, Surge = 5.2V; Note: See Data Sheet for full range of components; Value: 100uF/6,3V; Published: 19-Mar-2004; DatasheetDocument: 05-Feb-2003; PackageReference: 3528; Publisher: Altium Limited; Code_JEITA: 3528; ComponentLink1Description: Manufacturer Link; ComponentLink1URL: http://www.vishay.com/; ComponentLink2Description: Datasheet; ComponentLink2URL: http://www.vishay.com/docs/40002/293d.pdf
D2 = SMMSD301T1G: Schottky Barrier Diode, 2-Pin SOD-123, Pb-Free, Tape and Reel; Manufacturer: On Semiconductor; Configuration: Single; DatasheetVersion: Rev. 6; PackageVersion: Rev. G, 10/2009; PackageReference: SOD-123-2-425-04; PackageDescription: 2-Pin SOD, Body 1.6 x 2.69 mm; Supplier 1: Digi-Key; Supplier Part Number 1: SMMSD301T1G-ND; Supplier 2: Mouser; Supplier Part Number 2: 863-SMMSD301T1G; Packing: Tape and Reel; RoHS: TRUE; Mounting Technology: Surface Mount; PartNumber: SMMSD301T1G; ComponentLink1Description: Manufacturer URL; ComponentLink1URL: http://www.onsemi.com/; ComponentLink2Description: Datasheet; ComponentLink2URL: http://www.onsemi.cn/pub_link/Collateral/MMSD301T1-D.PDF; ComponentLink3Description: Package Specification; ComponentLink3URL: http://www.onsemi.com/pub_link/Collateral/425-04.PDF
L4 = 74404024047: WE-LQS SMD Power Inductor, L=4.7 µH; Inductance: 4.7 µH; PackageReference: WE-LQS 252012; PartNumber: 74404024047; ComponentLink1Description: Manufacturer URL; ComponentLink1URL: http://www.we-online.com; ComponentLink2Description: Datasheet; ComponentLink2URL: http://katalog.we-online.de/pbs/datasheet/74404024047.pdf
L5 L7-L10 = Inductor_SMD: Inductor; Code_IEC: 1005; Published: 8-Jun-2000; LatestRevisionDate: 29-May-2009; LatestRevisionNote: IPC-7351 Footprint Added.; PackageReference: 0402-A; Publisher: Altium Limited; PackageDescription: Chip Inductor; Code_JEITA: 0402
P4 = TS_Connector: 10 pin PFC connector bottom
P7 = Header 4X2: Header, 4-Pin, Dual row; LatestRevisionDate: 17-Jul-2002; LatestRevisionNote: Re-released for DXP Platform.; Publisher: Altium Limited
P8 = TFT LCD Connector: 40 pin pfc connector bottom
P10 = Header 5X2: Header, 5-Pin, Dual row; LatestRevisionDate: 17-Jul-2002; LatestRevisionNote: Re-released for DXP Platform.; Publisher: Altium Limited
P12 = Header 8: Header, 8-Pin; LatestRevisionDate: 17-Jul-2002; LatestRevisionNote: Re-released for DXP Platform.; Publisher: Altium Limited
Q1-Q4 = BSS123: N-channel Enhancement Mode Vertical D-MOSFET; Published: 17-Sep-2003; LatestRevisionDate: 12-Dec-2006; LatestRevisionNote: IPC-7351 Footprint Added.; DatasheetVersion: Apr-1995; PackageVersion: May-1999; PackageReference: SOT23; Publisher: Altium Limited; PackageDescription: 3-Pin SOT-23 Package 0.95 mm Pitch, 2.3 mm Lead Span; ComponentLink1Description: Manufacturer Link; ComponentLink1URL: http://www.semiconductors.philips.com/; ComponentLink2Description: Datasheet; ComponentLink2URL: http://www.semiconductors.philips.com/acrobat/datasheets/BSS123_3.pdf
R45 R46 R48 R51-R55 = ERAV: Metal Film Thermosensitive Chip Resistor, 0.56 Ohm to 10k Ohm Range, 5% Tolerance, 0603 Size, 0.063 W; Note: If flow soldering, adjust pad width of PCB Footprint to 0.7 - 0.8 times the width of the resistor.; Published: 17-Dec-2003; LatestRevisionDate: 19-Mar-2004; LatestRevisionNote: Silkscreen size reduced.; PackageDocument: Mar-2003; PackageReference: ERA-0603; Publisher: Altium Limited; Code_IPC: 1608 [0603]; ComponentLink1Description: Manufacturer Link; ComponentLink1URL: http://www.panasonic.com/industrial/components/resistive_products.htm; ComponentLink2Description: Datasheet; ComponentLink2URL: http://www.panasonic.com/industrial/components/pdf/AOF0000CE1.pdf
  R51 R52 R54 R55: Value: 2K2
R47 = ERAS: Metal Film Thermosensitive Chip Resistor, 0.56 Ohm to 10k Ohm Range, 5% Tolerance, 0805 Size, 0.1 W; Note: If flow soldering, adjust pad width of PCB Footprint to 0.7 - 0.8 times the width of the resistor.; Published: 17-Dec-2003; LatestRevisionDate: 19-Mar-2004; LatestRevisionNote: Silkscreen size reduced.; PackageDocument: Mar-2003; PackageReference: ERA-0805; Publisher: Altium Limited; Code_IPC: 2012 [0805]; ComponentLink1Description: Manufacturer Link; ComponentLink1URL: http://www.panasonic.com/industrial/components/resistive_products.htm; ComponentLink2Description: Datasheet; ComponentLink2URL: http://www.panasonic.com/industrial/components/pdf/AOF0000CE1.pdf
R57-R61 = ERA3Y: as R12 on sheet DE-020717_1; Published: 17-Dec-2003; LatestRevisionDate: 19-Mar-2004; LatestRevisionNote: Silkscreen size reduced.; PackageDocument: Mar-2003; PackageReference: ERA-0603; Publisher: Altium Limited; Code_IPC: 1608 [0603]; ComponentLink1Description: Manufacturer Link; ComponentLink1URL: http://www.panasonic.com/industrial/components/resistive_products.htm; ComponentLink2Description: Datasheet; ComponentLink2URL: http://www.panasonic.com/industrial/components/pdf/AOA0000CE8.pdf
U6 = STLD40DPUR: White Led Power Supply For Large Display Backlight, 8-Pin VFDFPN, Tape and Reel; DatasheetVersion: May-2011; PackageVersion: 2011; PackageReference: QFN8; PackageDescription: 8-Pin Dual Flat No-Lead, 3 x 3 mm Body, 0.65 mm Pitch, Exposed Pad; ComponentLink1Description: Manufacturer URL; ComponentLink1URL: http://www.st.com; ComponentLink2Description: Datasheet; ComponentLink2URL: http://www.st.com/internet/com/TECHNICAL_RESOURCES/TECHNICAL_LITERATURE/DATASHEET/CD00098098.pdf
U8 = MAX485CSA: Low-Power, Slew-Rate-Limited RS-485/RS-422 Transceiver; Published: 16-Jan-2001; LatestRevisionDate: 13-Apr-2006; LatestRevisionNote: IPC-7351 Footprint Added.; DatasheetVersion: Feb-1996; PackageReference: NSO8; Publisher: Altium Limited; PackageDescription: 8-Pin Small Outline Integrated Circuit 1.27 mm Pitch; Code_JEDEC: MS-012-AA; Code_IPC: SOIC127P600-8; ComponentLink1Description: Manufacturer Link; ComponentLink1URL: http://www.maxim-ic.com/; ComponentLink2Description: Datasheet; ComponentLink2URL: http://pdfserv.maxim-ic.com/en/ds/MAX1487-MAX491.pdf
U9 = M24128RMN1: 128 K Serial I˛C Bus EEPROM; Published: 24-Aug-2001; LatestRevisionDate: 13-Apr-2006; LatestRevisionNote: IPC-7351 Footprint Added.; DatasheetVersion: Feb-1998; PackageVersion: Jul-1999; PackageReference: SOP8; Publisher: Altium Limited; PackageDescription: 8-Pin Small Outline Integrated Circuit 1.27 mm Pitch; ComponentLink1Description: Manufacturer Link; ComponentLink1URL: http://www.st.com/
U10 = N25Q128A13ESE40E: 128 Mb (x1/x2/x4) Serial NOR Flash Memory with Multi I/O, 108 MHz, 2.7 to 3.6 V, 8-pin SO8 Wide (SE), Tray; Part Family: N25Q; Manufacturer: Micron; Density: 128Mb; Speed: 108 MHz; Voltage: 2.7V-3.6V; DatasheetVersion: Rev. L; PackageVersion: Rev. E; PackageReference: MICT-SE-8; PackageDescription: 8-Pin SO Wide, 5.29 X 5.29 mm, Pitch 1.27 mm; Applications: Embedded; Package: SO8 Wide; Part Status: Production; RoHS: Yes; Type: Multi I/O; Width: x1/x2/x4; Mounting Technology: Surface Mount; PartNumber: N25Q128A13ESE40E; ComponentLink1Description: Manufacturer URL; ComponentLink1URL: http://www.micron.com/; ComponentLink2Description: Datasheet; ComponentLink2URL: http://www.micron.com/~/media/Documents/Products/Data%20Sheet/NOR%20Flash/Serial%20NOR/N25Q/n25q_128mb_3v_65nm.pdf; ComponentLink3Description: Package Specification; ComponentLink3URL: http://www.micron.com/~/media/Documents/Products/Data%20Sheet/NOR%20Flash/Serial%20NOR/N25Q/n25q_32mb_1_8v_65nm.pdf
U11 = L7805CV: Positive Voltage Regulator, 5V, 3-Pin TO-220; DatasheetVersion: Nov-2011; PackageVersion: ver3.0; PackageReference: TO220; PackageDescription: TO, Thru-Hole, Vertical, Heatsink Mounted; 3 In-Line Leads; Pitch 2.54 mm; PartNumber: L7805CV; ComponentLink1Description: Manufacturer URL; ComponentLink1URL: http://www.st.com; ComponentLink2Description: Datasheet; ComponentLink2URL: http://www.st.com/internet/com/TECHNICAL_RESOURCES/TECHNICAL_LITERATURE/DATASHEET/CD00000444.pdf; ComponentLink3Description: Package Specification; ComponentLink3URL: http://www.st.com/internet/com/TECHNICAL_RESOURCES/TECHNICAL_LITERATURE/PACKAGE_INFORMATION/CD00004649.pdf
U12 = REG1117-3.3: 800mA and 1A Low Dropout Positive Regulator 2.85V, 3.3V, 5V, and Adjustable; Published: 8-Jun-2000; LatestRevisionDate: 17-Jul-2002; LatestRevisionNote: Re-released for DXP Platform.; DatasheetVersion: Sep-1997; PackageVersion: revC; PackageReference: ZZ311; Publisher: Altium Limited; PackageDescription: SOT-223/SC-73; 4 Leads; Body 6.7 x 7.3 mm, inc. leads (LxW max); ComponentLink1Description: Manufacturer Link; ComponentLink1URL: http://www.ti.com/; ComponentLink2Description: Datasheet; ComponentLink2URL: http://www-s.ti.com/sc/ds/REG1117.pdf

## Nets that join several sheets
+3V3: DE-020717_1 (13 pins), DE-020717_2 (25 pins)
+5V: DE-020717_1 (C44.2 P11.8), DE-020717_2 (14 pins)
VSS: DE-020717_1 (104 pins), DE-020717_2 (58 pins)
EEPROM_NCS: DE-020717_1 (U1.87), DE-020717_2 (R60.2 U9.7)
I2C3_SCL: DE-020717_1 (R21.2 U1.100), DE-020717_2 (P4.3)
I2C3_SDA: DE-020717_1 (R23.2 U1.99), DE-020717_2 (P4.5)
I2C4_SCL: DE-020717_1 (R25.2 U1.81), DE-020717_2 (P10.9 U9.6)
I2C4_SDA: DE-020717_1 (R26.2 U1.82), DE-020717_2 (P10.10 U9.5)
LCD_BL_CTRL: DE-020717_1 (U1.4), DE-020717_2 (R48.2)
LCD_DE: DE-020717_1 (U1.3), DE-020717_2 (P8.34)
LCD_DISP: DE-020717_1 (U1.1), DE-020717_2 (P8.31 R58.2)
LTDC_B3: DE-020717_1 (U1.126), DE-020717_2 (P8.24)
LTDC_B4: DE-020717_1 (U1.127), DE-020717_2 (P8.25)
LTDC_B5: DE-020717_1 (U1.37), DE-020717_2 (P8.26)
LTDC_B6: DE-020717_1 (U1.139), DE-020717_2 (P8.27)
LTDC_B7: DE-020717_1 (U1.140), DE-020717_2 (P8.28)
LTDC_CLK: DE-020717_1 (U1.92), DE-020717_2 (P8.30)
LTDC_G2: DE-020717_1 (U1.42), DE-020717_2 (P8.15)
LTDC_G3: DE-020717_1 (U1.125), DE-020717_2 (P8.16)
LTDC_G4: DE-020717_1 (U1.69), DE-020717_2 (P8.17)
LTDC_G5: DE-020717_1 (U1.70), DE-020717_2 (P8.18)
LTDC_G6: DE-020717_1 (U1.97), DE-020717_2 (P8.19)
LTDC_G7: DE-020717_1 (U1.117), DE-020717_2 (P8.20)
LTDC_HSYNC: DE-020717_1 (U1.96), DE-020717_2 (P8.32)
LTDC_R3: DE-020717_1 (U1.46), DE-020717_2 (P8.8)
LTDC_R4: DE-020717_1 (U1.41), DE-020717_2 (P8.9)
LTDC_R5: DE-020717_1 (U1.26), DE-020717_2 (P8.10)
LTDC_R6: DE-020717_1 (U1.47), DE-020717_2 (P8.11)
LTDC_R7: DE-020717_1 (U1.91), DE-020717_2 (P8.12)
LTDC_VSYNC: DE-020717_1 (U1.40), DE-020717_2 (P8.33)
NRF24L01_CE: DE-020717_1 (U1.88), DE-020717_2 (P7.3)
ONE_WIRE_RX: DE-020717_1 (U1.122), DE-020717_2 (Q1.3 R53.2)
ONE_WIRE_TX: DE-020717_1 (U1.119), DE-020717_2 (Q4.1 R54.1)
QSPI_BK1_IO0: DE-020717_1 (U1.20), DE-020717_2 (U10.5)
QSPI_BK1_IO1: DE-020717_1 (U1.21), DE-020717_2 (U10.2)
QSPI_BK1_IO2: DE-020717_1 (U1.19), DE-020717_2 (U10.3)
QSPI_BK1_IO3: DE-020717_1 (U1.18), DE-020717_2 (U10.7)
QSPI_BK1_NCS: DE-020717_1 (U1.136), DE-020717_2 (R61.2 U10.1)
QSPI_CLK: DE-020717_1 (U1.48), DE-020717_2 (U10.6)
RS485_DIR: DE-020717_1 (U1.104), DE-020717_2 (U8.2 U8.3)
RS485_RX: DE-020717_1 (U1.102), DE-020717_2 (R57.1 R59.1)
RS485_TX: DE-020717_1 (U1.101), DE-020717_2 (U8.4)
SAI2_FS_B: DE-020717_1 (U1.124), DE-020717_2 (P10.6)
SAI2_MCLK_B: DE-020717_1 (U1.5), DE-020717_2 (P10.7)
SAI2_SCK_B: DE-020717_1 (U1.36), DE-020717_2 (P10.5)
SAI2_SD_A: DE-020717_1 (U1.80), DE-020717_2 (P10.8)
SAI2_SD_B: DE-020717_1 (U1.34), DE-020717_2 (P10.3)
SPI2_MISO: DE-020717_1 (U1.75), DE-020717_2 (P7.7)
SPI2_MOSI: DE-020717_1 (U1.76), DE-020717_2 (P7.6)
SPI2_NSS: DE-020717_1 (U1.73), DE-020717_2 (P7.4)
SPI2_SCK: DE-020717_1 (U1.74), DE-020717_2 (P7.5)
TS_INT: DE-020717_1 (U1.2), DE-020717_2 (P4.9)
TS_RESET: DE-020717_1 (U1.7), DE-020717_2 (P4.7)